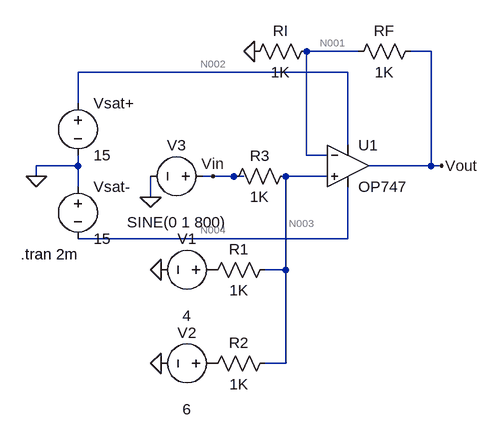
[diagram p0: schematic NON_INVERTING_SUMMER.asc]
NON_INVERTING_SUMMER.asc, the LTspice schematic file:
Version 4
SHEET 1 880 680
WIRE 352 -16 272 -16
WIRE 464 -16 432 -16
WIRE 336 16 -80 16
WIRE -80 64 -80 16
WIRE 336 128 336 16
WIRE 272 144 272 -16
WIRE 304 144 272 144
WIRE -80 160 -80 144
WIRE -80 160 -144 160
WIRE 464 160 464 -16
WIRE 464 160 368 160
WIRE 480 160 464 160
WIRE -144 176 -144 160
WIRE 128 176 112 176
WIRE 160 176 128 176
WIRE 176 176 160 176
WIRE 304 176 240 176
WIRE -80 192 -80 160
WIRE 32 208 32 176
WIRE 336 272 336 192
WIRE 336 272 -80 272
WIRE 240 320 240 176
WIRE 240 320 208 320
WIRE 240 464 240 320
WIRE 240 464 208 464
FLAG -144 176 0
FLAG 32 208 0
FLAG 480 160 Vout
FLAG 128 176 Vin
FLAG 48 464 0
FLAG 48 320 0
FLAG 192 -16 0
SYMBOL OpAmps\\OP747 336 96 R0
SYMATTR InstName U1
SYMBOL voltage -80 48 R0
WINDOW 123 0 0 Left 0
WINDOW 39 0 0 Left 0
SYMATTR InstName Vsat+
SYMATTR Value 15
SYMBOL voltage -80 176 R0
WINDOW 123 0 0 Left 0
WINDOW 39 0 0 Left 0
SYMATTR InstName Vsat-
SYMATTR Value 15
SYMBOL voltage 128 176 R90
WINDOW 0 -32 56 VBottom 2
WINDOW 3 55 56 VTop 2
WINDOW 123 0 0 Left 0
WINDOW 39 0 0 Left 0
SYMATTR InstName V3
SYMATTR Value SINE(0 1 800)
SYMBOL voltage 144 320 R90
WINDOW 0 -32 56 VBottom 2
WINDOW 3 55 56 VTop 2
WINDOW 123 0 0 Left 0
WINDOW 39 0 0 Left 0
SYMATTR InstName V1
SYMATTR Value 4
SYMBOL voltage 144 464 R90
WINDOW 0 -32 56 VBottom 2
WINDOW 3 55 56 VTop 2
WINDOW 123 0 0 Left 0
WINDOW 39 0 0 Left 0
SYMATTR InstName V2
SYMATTR Value 6
SYMBOL res 224 448 R90
WINDOW 0 0 56 VBottom 2
WINDOW 3 32 56 VTop 2
SYMATTR InstName R2
SYMATTR Value 1K
SYMBOL res 448 -32 R90
WINDOW 0 0 56 VBottom 2
WINDOW 3 32 56 VTop 2
SYMATTR InstName RF
SYMATTR Value 1K
SYMBOL res 256 160 R90
WINDOW 0 0 56 VBottom 2
WINDOW 3 32 56 VTop 2
SYMATTR InstName R3
SYMATTR Value 1K
SYMBOL res 224 304 R90
WINDOW 0 0 56 VBottom 2
WINDOW 3 32 56 VTop 2
SYMATTR InstName R1
SYMATTR Value 1K
SYMBOL res 288 -32 R90
WINDOW 0 0 56 VBottom 2
WINDOW 3 32 56 VTop 2
SYMATTR InstName RI
SYMATTR Value 1K
TEXT -168 296 Left 2 !.tran 2m

The netlist it stands for:
* NON_INVERTING_SUMMER.asc
XU1 N003 N001 N002 N004 Vout OP747  ; pins In+ In- V+ V- OUT
Vsat+ N002 0 15
Vsat- 0 N004 15
V3 Vin 0 SINE(0 1 800)
V1 P001 0 4
V2 P002 0 6
R2 N003 P002 1K
RF Vout N001 1K
R3 N003 Vin 1K
R1 N003 P001 1K
RI N001 0 1K
.tran 2m
.backanno
.end

* Results of the author's LTspice run, read from the files saved beside the schematic
* Operating Point, zero values left out:
*   V(n001) = 3.333 V
*   V(n004) = -15 V
*   V(n002) = 15 V
*   V(n003) = 3.333 V
*   V(vout) = 6.667 V
*   V(p001) = 4 V
*   V(p002) = 6 V
*   I(Ri) = 3.333 mA
*   I(R1) = -666.7 µA
*   I(R3) = 3.333 mA
*   I(Rf) = 3.333 mA
*   I(R2) = -2.667 mA
*   I(V2) = -2.667 mA
*   I(V1) = -666.7 µA
*   I(V3) = 3.333 mA
*   I(Vsat-) = -128 µA
*   I(Vsat+) = -3.461 mA
*   Ix(u1:1) = -10.63 nA
*   Ix(u1:2) = -8.635 nA
*   Ix(u1:99) = 3.461 mA
*   Ix(u1:50) = -128 µA
*   Ix(u1:45) = -3.333 mA
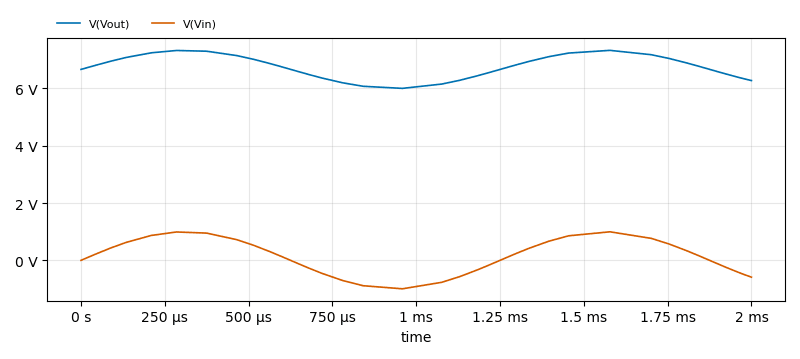
[diagram p1: Transient Analysis of NON_INVERTING_SUMMER.asc, plotted from the saved traces]
* Transient Analysis, 1 run:
*   V(Vout): min 6.004 V, max 7.331 V, average 6.785 V, rms 6.799 V, last 6.276 V
*   V(Vin): min -993.6 mV, max 996.2 mV, average 177.1 mV, rms 680.9 mV, last -587.8 mV